# EasyEDA Pro project ProDoc_PCB1_2025-11-01.epro

# Board PCB1
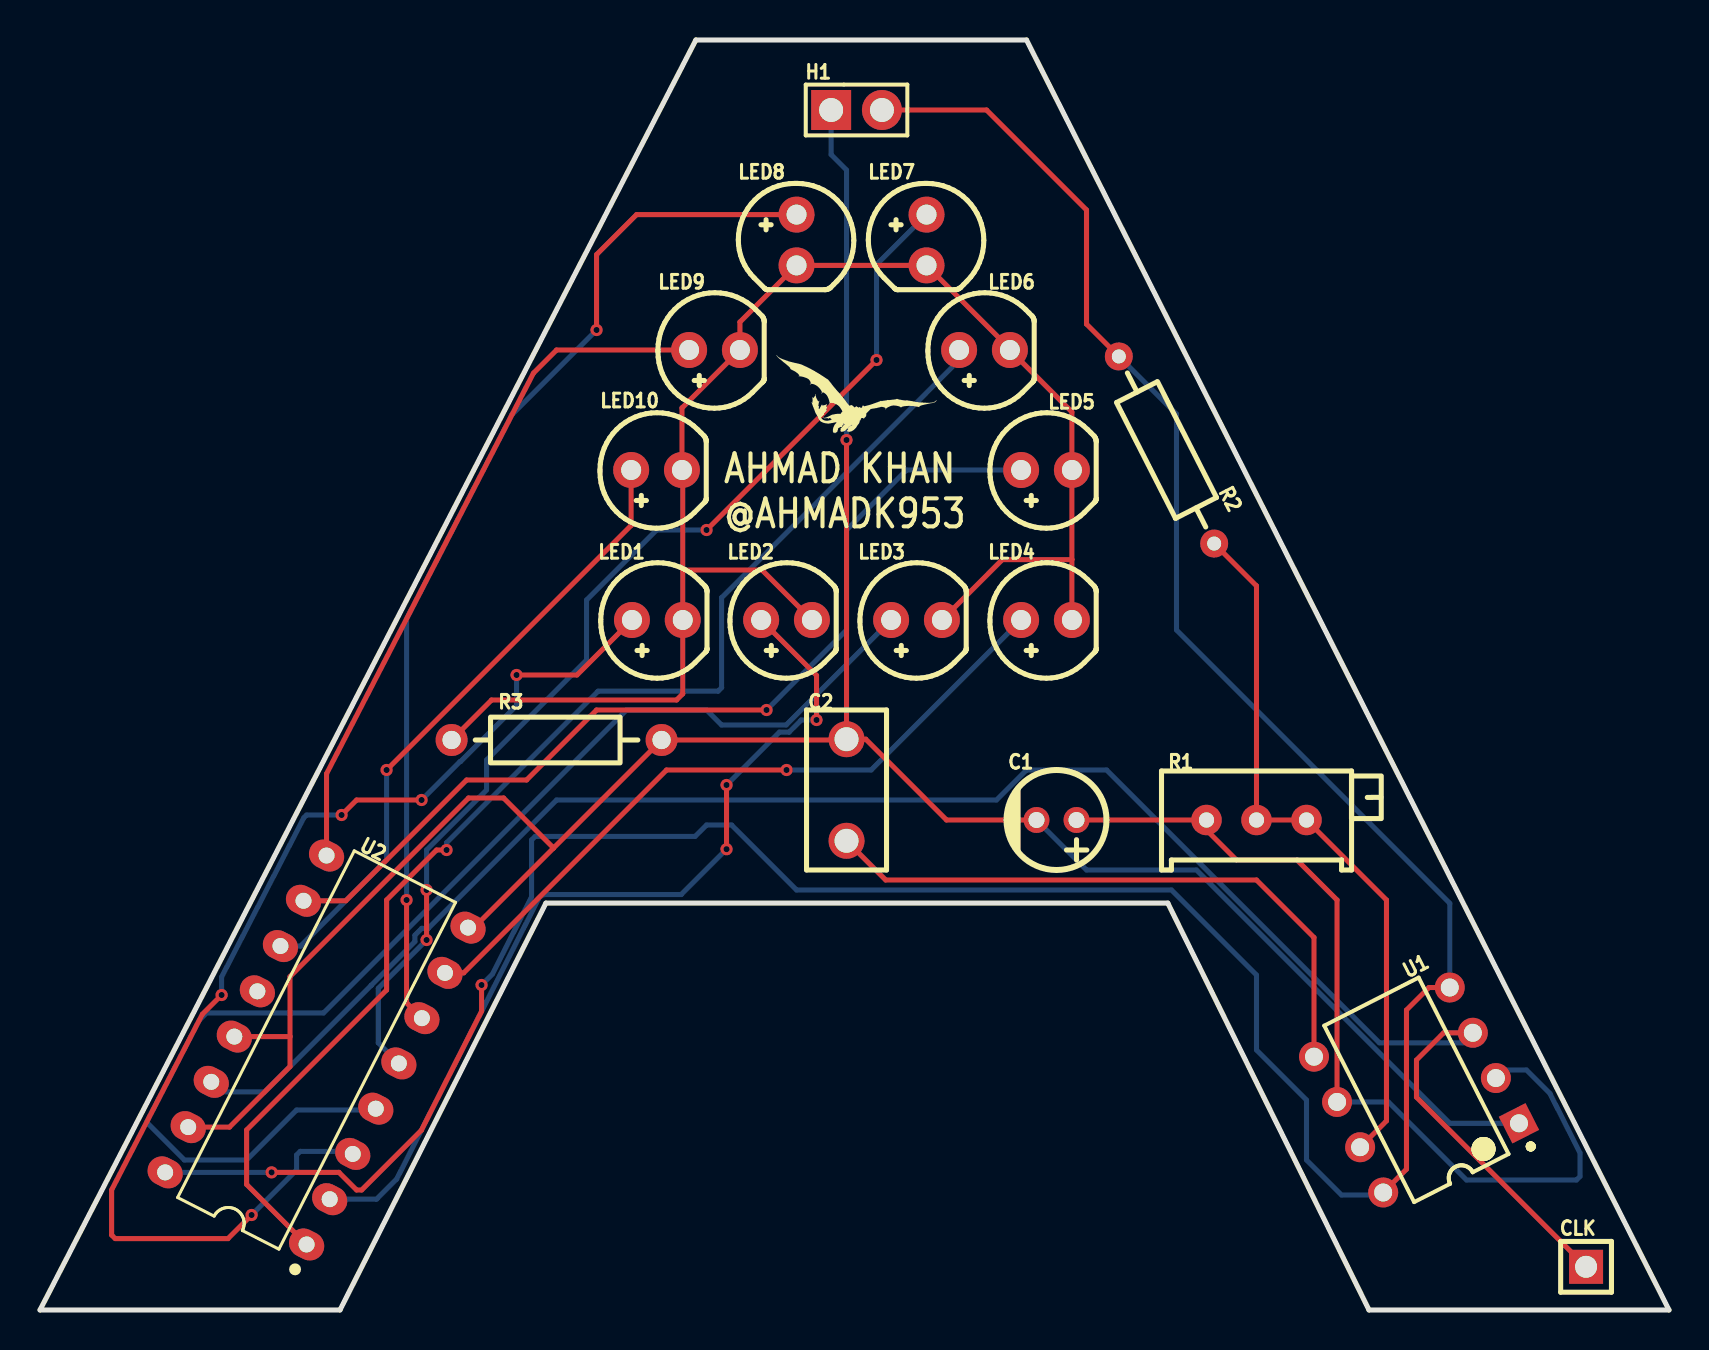
[diagram p0: board, top side]
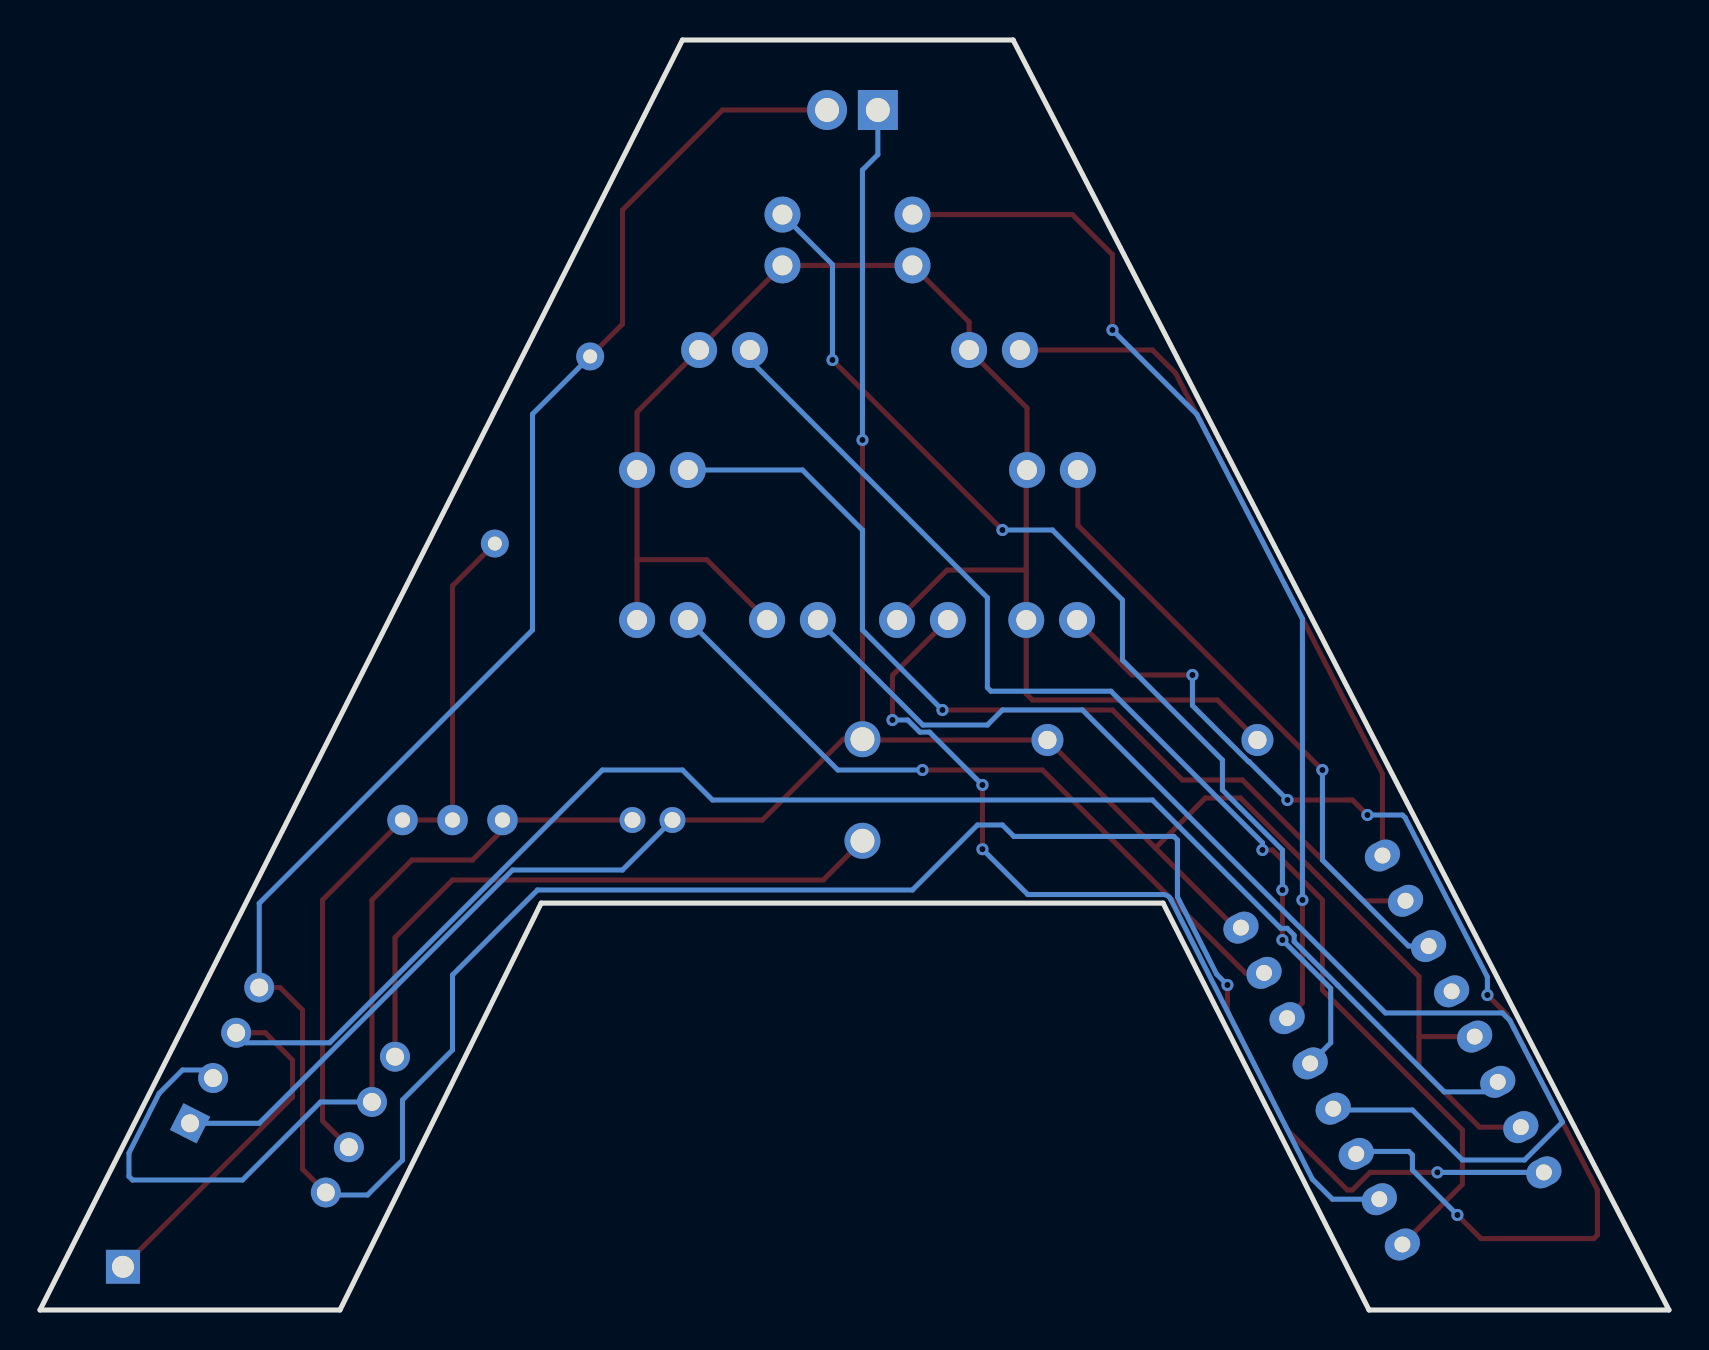
[diagram p1: board, bottom side, seen from below]

Outline 81.46 x 63.5 mm; copper layers: Top Layer, Bottom Layer. Coordinates in mm from the lower left corner of the outline.
Outline path: 0,0 15,0 25.3,20.34 56.4,20.34 66.46,0 81.46,0 49.33,63.5 32.8,63.5 0,0
Stack: Top Layer 0.035mm / Dielectric1 1.51mm FR4 er 4.5 / Bottom Layer 0.035mm

## Design rules (mm)
template: JLCPCB Capability(Two Layers Board)
spacing copperThickness1oz (default): track to track 0.102, other pairs 0.152 to 0.3
spacing copperThickness2oz: track to track 0.203, other pairs 0.152 to 0.3
track width copperThickness1oz (default): min 0.127, default 0.254, max 2.54
track width copperThickness2oz: min 0.203, default 0.254, max 2.54
differential pair differentialPair (default): width min 0.127, default 0.254, max 2.54; gap min 0.152, default 0.152
via viaSize (default): diameter min 0.5, default 0.61, max 10; hole min 0.3, default 0.305, max 6.3

## Placement (name value [footprint] x y rotation side)
C1  1uF  [CAP-TH_BD5.0-P2.00-D0.8-FD]  50.83 24.5 180 top
C2  10nF  [CAP-TH_L8.0-W4.0-P5.00-D1.2]  40.33 26 270 top
CLK  2.54-1*1P针  [HDR-TH_1P-P2.54-V-M]  77.31 2.16 0 top
H1  Power Header  [HDR-TH_2P-P2.54-V-M]  40.83 60 0 top
LED1  XL-502UWC  [LED-TH_BD5.9-P2.54-RD_WHITE]  30.87 34.5 180 top
LED2  XL-502UWC  [LED-TH_BD5.9-P2.54-RD_WHITE]  37.33 34.5 180 top
LED3  XL-502UWC  [LED-TH_BD5.9-P2.54-RD_WHITE]  43.83 34.5 180 top
LED4  XL-502UWC  [LED-TH_BD5.9-P2.54-RD_WHITE]  50.33 34.5 180 top
LED5  XL-502UWC  [LED-TH_BD5.9-P2.54-RD_WHITE]  50.33 42 180 top
LED6  XL-502UWC  [LED-TH_BD5.9-P2.54-RD_WHITE]  47.23 48 180 top
LED7  XL-502UWC  [LED-TH_BD5.9-P2.54-RD_WHITE]  44.33 53.5 90 top
LED8  XL-502UWC  [LED-TH_BD5.9-P2.54-RD_WHITE]  37.83 53.5 90 top
LED9  XL-502UWC  [LED-TH_BD5.9-P2.54-RD_WHITE]  33.73 48 180 top
LED10  XL-502UWC  [LED-TH_BD5.9-P2.54-RD_WHITE]  30.83 42 180 top
R1  50kΩ  [RES-ADJ-TH_3P-L9.5-W4.85-P2.50-BL-L]  60.83 24.5 90 top
R2  1kΩ  [RES-TH_BD2.3-L6.5-P10.50-D0.5]  56.33 43 117 top
R3  470Ω  [RES-TH_BD2.2-L6.5-P10.50-D0.6]  25.83 28.5 180 top
U1  NE555P  [DIP-8_L9.8-W6.6-P2.54-LS7.6-BL]  68.83 11 117 top
U2  CD4017BE(LX)  [PDIP-16_L19.3-W6.4-P2.54-LS7.94-BL]  13.83 13 63 top

## Footprints (pads in the part's own frame, mm; a bottom-side part is the same pattern mirrored in y, then rotated)
CAP-TH_BD5.0-P2.00-D0.8-FD
  round 1.3 hole 0.8: 1(-1,0) 2(1,0)
CAP-TH_L8.0-W4.0-P5.00-D1.2
  round 1.8 hole 1.2: 1(-2.54,0) 2(2.54,0)
DIP-8_L9.8-W6.6-P2.54-LS7.6-BL
  rect 1.5x1.5 hole 0.9: 1(-3.81,-3.81)
  round 1.5 hole 0.9: 2(-1.27,-3.81) 3(1.27,-3.81) 4(3.81,-3.81) 5(3.81,3.81) 6(1.27,3.81) 7(-1.27,3.81) 8(-3.81,3.81)
HDR-TH_1P-P2.54-V-M
  rect 1.7x1.7 hole 1.1: 1(0,0)
HDR-TH_2P-P2.54-V-M
  rect 2x2 hole 1.2: 1(-1.27,0)
  round 2 hole 1.2: 2(1.27,0)
LED-TH_BD5.9-P2.54-RD_WHITE
  round 1.8 hole 1: 1(-1.27,0) 2(1.27,0)
PDIP-16_L19.3-W6.4-P2.54-LS7.94-BL
  oval 1.44x1.8 hole 0.8: 1(-8.89,-3.97) 2(-6.35,-3.97) 3(-3.81,-3.97) 4(-1.27,-3.97) 5(1.27,-3.97) 6(3.81,-3.97) 7(6.35,-3.97) 8(8.89,-3.97) 9(8.89,3.97) 10(6.35,3.97) 11(3.81,3.97) 12(1.27,3.97) 13(-1.27,3.97) 14(-3.81,3.97) 15(-6.35,3.97) 16(-8.89,3.97)
RES-ADJ-TH_3P-L9.5-W4.85-P2.50-BL-L
  round 1.524 hole 0.762: 1(0,2.5) 2(0,0) 3(0,-2.5)
RES-TH_BD2.2-L6.5-P10.50-D0.6
  round 1.6 hole 0.914: 1(-5.25,0) 2(5.25,0)
RES-TH_BD2.3-L6.5-P10.50-D0.5
  round 1.4 hole 0.7: 1(-5.25,0) 2(5.25,0)

## Nets
$1N1239: H1.2 R2.2 U1.4 U1.8 U2.16
$1N1299: R1.2 R1.3 R2.1 U1.7
$1N1328: C1.1 R1.1 U1.2 U1.6
$1N2018: LED10.2 U2.11
$1N2025: LED9.2 U2.9
$1N2032: LED8.2 U2.6
$1N2039: LED7.2 U2.5
$1N2046: LED6.2 U2.1
$1N2053: LED5.2 U2.10
$1N2060: LED4.2 U2.7
$1N2067: LED3.2 U2.4
$1N2074: LED2.2 U2.2
$1N2081: LED1.2 U2.3
$1N2125: CLK.1 U1.3 U2.14
$1N2164: LED1.1 LED2.1 LED3.1 LED4.1 LED5.1 LED6.1 LED7.1 LED8.1 LED9.1 LED10.1 R3.2
$1N2175: C1.2 C2.1 H1.1 R3.1 U1.1 U2.8 U2.13 U2.15
$1N2288: C2.2 U1.5

Pads without a net: U2 12

## Via types
v1: diameter 0.61, hole 0.305, Top Layer to Bottom Layer, 21 vias

## Routing (per net, layer and track width the routed paths; a pad name or vN(x,y) marks a point on that pad's centre or on a via; arc(x,y) is an arc through that point)
$1N1239: length 155.8
  Top Layer w0.254: v1(22.08,16.25) 22.08,14.93 19.07,8.98 16.08,6 15.83,6 14.95,6.88 v1(11.58,6.88) ; U1.8 68.33,7.04 68.33,15 69.46,16.12 U1.4 ; R2.2 52.33,49.29 52.33,55 47.33,60 H1.2
  Bottom Layer w0.254: U1.8 67.04,5.75 65.08,5.75 63.33,7.5 63.33,10.5 60.83,13 60.83,16.75 56.58,21 37.83,21 34.58,24.25 33.33,24.25 32.76,23.68 24.76,23.68 24.58,23.5 24.58,20.66 22.62,16.79 v1(22.08,16.25) ; U1.4 70.5,20.33 56.83,34 56.83,44.79 R2.2 ; U2.16 v1(11.58,6.88)
$1N1299: length 35.8
  Top Layer w0.254: U1.7 67.33,9.46 67.33,20.5 R1.3 R1.2 60.83,36.21 R2.1
$1N1328: length 46.8
  Top Layer w0.254: C1.1 R1.1 58.33,24 59.83,22.5 62.86,22.5 64.86,20.5 U1.6
  Bottom Layer w0.254: U1.6 67.43,10.4 71.33,6.5 76.83,6.5 77.01,6.68 77.01,7.85 75.5,10.83 74.33,12 73.2,12 U1.2
$1N2018: length 31.7
  Top Layer w0.254: LED10.2 29.56,39.23 v1(17.33,27)
  Bottom Layer w0.254: U2.11 13.03,18.2 17.33,22.5 v1(17.33,27)
$1N2025: length 34.9
  Top Layer w0.254: LED9.2 25.83,48 24.67,46.84 14.33,26.81 U2.9
$1N2032: length 52.4
  Top Layer w0.254: v1(27.83,49) 27.83,52.77 29.83,54.77 LED8.2 ; v1(18.33,20.5) 18.33,15.36 19.1,14.59
  Bottom Layer w0.254: v1(18.33,20.5) 18.33,34.56 23.61,44.78 v1(27.83,49)
$1N2039: length 55.7
  Top Layer w0.254: v1(19.33,21) v1(19.33,18.5) ; v1(41.83,47.5) v1(33.33,39)
  Bottom Layer w0.254: v1(19.33,21) 19.33,23 22.33,26 22.33,27.5 27.33,32.5 27.33,35.5 30.83,39 v1(33.33,39) ; LED7.2 41.83,52.27 v1(41.83,47.5) ; v1(19.33,18.5) 16.92,16.08 16.92,13.36 U2.5
$1N2046: length 64.6
  Top Layer w0.254: v1(20.33,23) 19.83,23 17.33,20.5 17.33,16 10.33,9 10.33,6.28 U2.1
  Bottom Layer w0.254: LED6.2 46.03,47.93 46.03,47.57 34.08,35.62 34.08,31.12 33.9,30.94 27.9,30.94 20.33,23.37 v1(20.33,23)
$1N2053: length 47.7
  Top Layer w0.254: v1(36.33,30) 27.83,30 24.33,26.5 21.33,26.5 15.29,20.46 U2.10
  Bottom Layer w0.254: v1(36.33,30) 40.33,34 40.33,39 43.33,42 LED5.2
$1N2060: length 36.1
  Top Layer w0.254: v1(37.33,27) 31.33,27 21.19,16.86 U2.7
  Bottom Layer w0.254: LED4.2 41.56,27 v1(37.33,27)
$1N2067: length 62.6
  Bottom Layer w0.254: LED3.2 37.31,29.25 34.08,29.25 33.33,30 29.33,30 14.18,14.85 8.33,14.85 7.96,14.48 5.33,9.39 7.22,7.5 10.33,7.5 12.83,10 16.72,10 U2.4
$1N2074: length 45.1
  Top Layer w0.254: v1(38.83,29.5) 38.83,31.73 LED2.2 ; v1(34.33,23.04) v1(34.33,26.25)
  Bottom Layer w0.254: U2.2 16.83,5.54 17.83,6.54 24.92,20.54 arc(25.07,20.71) 25.3,20.77 32.06,20.77 v1(34.33,23.04) ; v1(38.83,29.5) 38.06,29.5 37.46,28.89 36.97,28.89 v1(34.33,26.25)
$1N2081: length 59.2
  Top Layer w0.254: v1(19.08,25.5) 15.83,25.5 v1(15.08,24.75) ; v1(10.58,4.75) 9.4,3.57 3.76,3.57 3.58,3.75 3.58,6 8.12,14.79 v1(9.08,15.75) ; v1(23.83,31.75) 26.85,31.75 LED1.2
  Bottom Layer w0.254: v1(19.08,25.5) 21,27.42 21.03,27.42 23.83,30.22 v1(23.83,31.75) ; v1(9.08,15.75) 9.08,16.65 13.19,24.61 13.33,24.75 v1(15.08,24.75) ; v1(10.58,4.75) 12.83,7 12.83,7.75 13.01,7.93 15.51,7.93 U2.3
$1N2125: length 93.2
  Top Layer w0.254: CLK.1 68.83,10.64 68.83,12.5 70.19,13.86 U1.3
  Bottom Layer w0.254: 8.56,11.41 9.06,10.91 11.24,10.91 16.56,16.23 16.56,16.23 18.75,18.42 18.75,18.74 19.09,19.08 19.41,19.08 25.83,25.5 47.83,25.5 49.33,27 53.33,27 66.97,13.36 71.15,13.36 U1.3
$1N2164: length 78.8
  Top Layer w0.254: LED2.1 36.1,37 32.14,37 ; 32.14,37 32.14,41.96 LED10.1 32.1,45.1 LED9.1 35,49.4 LED8.1 LED7.1 48.5,48.06 LED6.1 51.6,44.9 LED5.1 51.6,37.52 ; 32.14,37 LED1.1 32.14,30.81 31.83,30.5 22.58,30.5 R3.2 ; 51.6,37.52 LED4.1 ; 51.6,37.52 48.12,37.52 LED3.1
$1N2175: length 127.7
  Top Layer w0.254: 25.68,23.1 21.7,19.12 U2.8 ; 25.68,23.1 23.18,25.6 21.43,25.6 12.5,16.67 12.5,13.67 ; 25.68,23.1 R3.1 40.29,28.5 C2.1 ; C2.1 v1(40.33,43.5) ; C2.1 41.29,28.54 45.33,24.5 C1.2 ; 12.5,13.67 12.5,12.17 9.47,9.14 U2.15 ; 12.5,13.67 U2.13
  Bottom Layer w0.254: H1.1 39.56,57.77 40.33,57 v1(40.33,43.5) ; 73.96,9.34 70.5,9.34 57.83,22 52.33,22 C1.2
$1N2288: length 31.3
  Top Layer w0.254: C2.2 42.29,21.5 60.83,21.5 63.71,18.62 U1.5

## Text on the board
Top Silkscreen Layer: AHMAD KHAN / @AHMADK953
